# EAGLE schematic M_H_ext_sound (EAGLE 9.6.2)
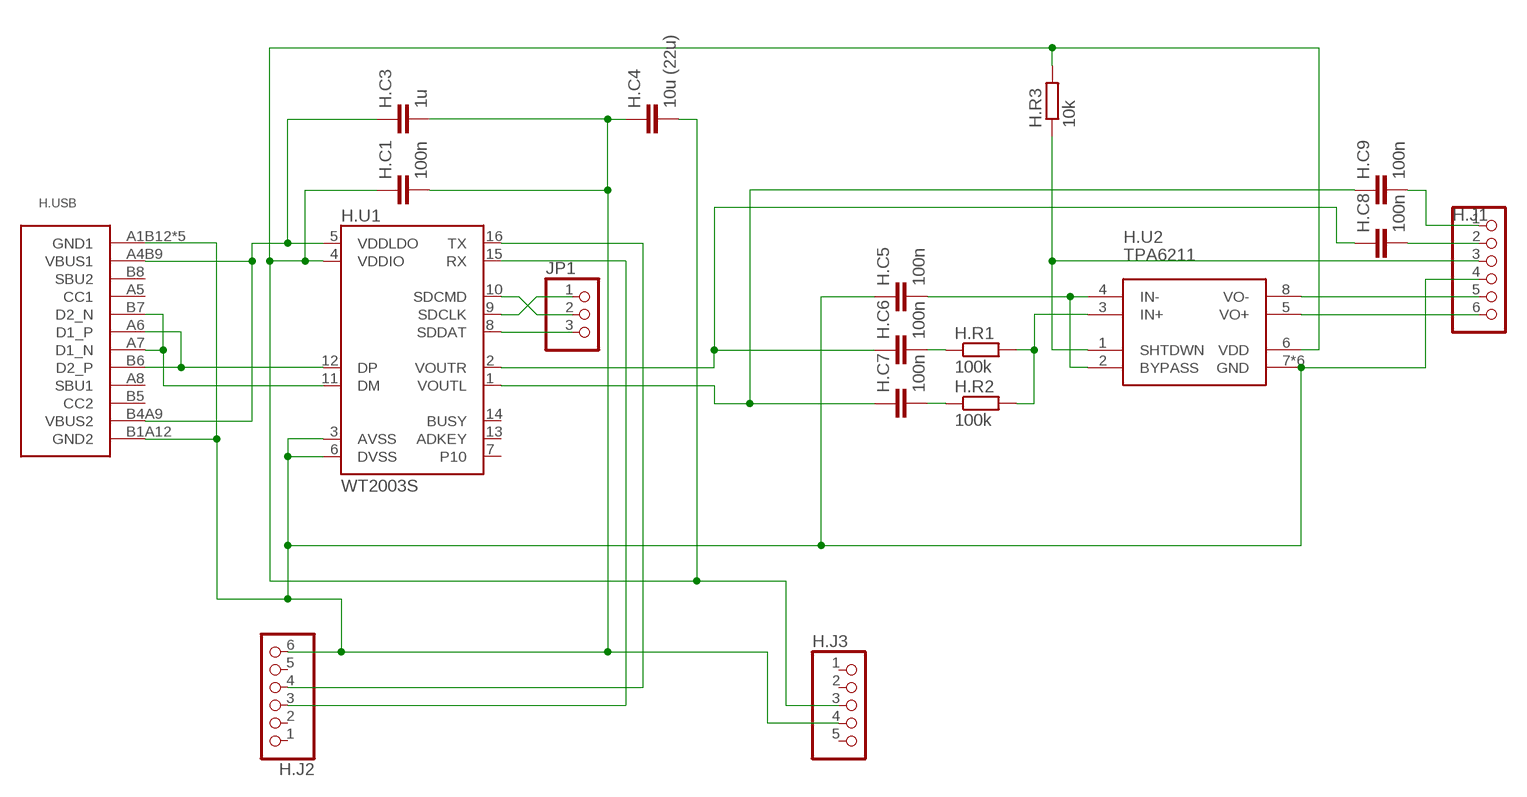
[diagram p0: schematic, sheet 1]

## Parts
H.C1  100n  C-EUC0603  [C0603]
H.C3  1u  C-EUC0603  [C0603]
H.C4  10u (22u)  C-EUC0805  [C0805]
H.C5  100n  C-EUC0603  [C0603]
H.C6  100n  C-EUC0603  [C0603]
H.C7  100n  C-EUC0603  [C0603]
H.C8  100n  C-EUC0603  [C0603]
H.C9  100n  C-EUC0603  [C0603]
H.J1  PINHD-1X6  [1X06]
H.J2  PINHD-1X6  [1X06]
H.J3  PINHD-1X5  [1X05]
H.R1  100k  R-EU_R0603  [R0603]
H.R2  100k  R-EU_R0603  [R0603]
H.R3  10k  R-EU_R0603  [R0603]
H.U1  WT2003S  [SO16]
H.U2  TPA6211  [MSOP-POWERPAD-8]
H.USB  USB-C  [USB-C]
JP1  PINHD-1X3  [1X03]

## Nets
GND: H.C1.2 H.C3.2 H.C4.1 H.C5.1 H.J1.4 H.J2.6 H.J3.4 H.U1.3(AVSS) H.U1.6(DVSS) H.U2.7(GND) H.U2.9(GND) H.U2.P$10(GND) H.U2.P$11(GND) H.U2.P$12(GND) H.U2.P$13(GND) H.USB.A1B12(GND1) H.USB.B1A12(GND2) H.USB.SH1(GND1) H.USB.SH2(GND1) H.USB.SH3(GND1) H.USB.SH4(GND1)
N$1: H.C8.2 H.J1.2
N$2: H.C9.2 H.J1.1
N$3: H.J1.5 H.U2.8(VO-)
N$4: H.J2.3 H.U1.15(RX)
N$5: H.J2.4 H.U1.16(TX)
N$6: H.J1.6 H.U2.5(VO+)
N$7: H.J1.3 H.R3.1 H.U2.1(SHTDWN)
N$8: H.U1.10(SDCMD) JP1.2
N$9: H.U1.12(DP) H.USB.A6(D1_P) H.USB.B6(D2_P)
N$10: H.U1.11(DM) H.USB.A7(D1_N) H.USB.B7(D2_N)
N$11: H.C3.1 H.U1.5(VDDLDO) H.USB.A4B9(VBUS1) H.USB.B4A9(VBUS2)
N$12: H.C6.1 H.C8.1 H.U1.2(VOUTR)
N$13: H.C7.1 H.C9.1 H.U1.1(VOUTL)
N$14: H.R1.2 H.R2.2 H.U2.3(IN+)
N$15: H.C5.2 H.U2.2(BYPASS) H.U2.4(IN-)
N$16: H.U1.9(SDCLK) JP1.1
N$17: H.C6.2 H.R1.1
N$18: H.C7.2 H.R2.1
N$19: H.U1.8(SDDAT) JP1.3
VCC: H.C1.1 H.C4.2 H.J3.3 H.R3.2 H.U1.4(VDDIO) H.U2.6(VDD)
Unconnected: H.J2.1 H.J2.2 H.J2.5 H.J3.1 H.J3.2 H.J3.5 H.U1.7(P10) H.U1.13(ADKEY) H.U1.14(BUSY) H.USB.A5(CC1) H.USB.A8(SBU1) H.USB.B5(CC2) H.USB.B8(SBU2)

## Library data of the parts
H.C1 H.C3-H.C9 = rcl:C-EU: CAPACITOR, European symbol; SPICEPREFIX: C
H.J1 H.J2 = pinhead2:PINHD-1X6: PIN HEADER
H.J3 = pinhead2:PINHD-1X5: PIN HEADER
H.R1-H.R3 = rcl:R-EU_: RESISTOR, European symbol; SPICEPREFIX: R
H.U1 = WT2003S:WT2003S
H.U2 = hugo:TPA6211
H.USB = hugo:USB-C
JP1 = pinhead2:PINHD-1X3: PIN HEADER